# Altium schematic sheet PM_Adapter_Pi_Pico_v3.SchDoc
size A4; SheetNumber: 1; SheetTotal: 1
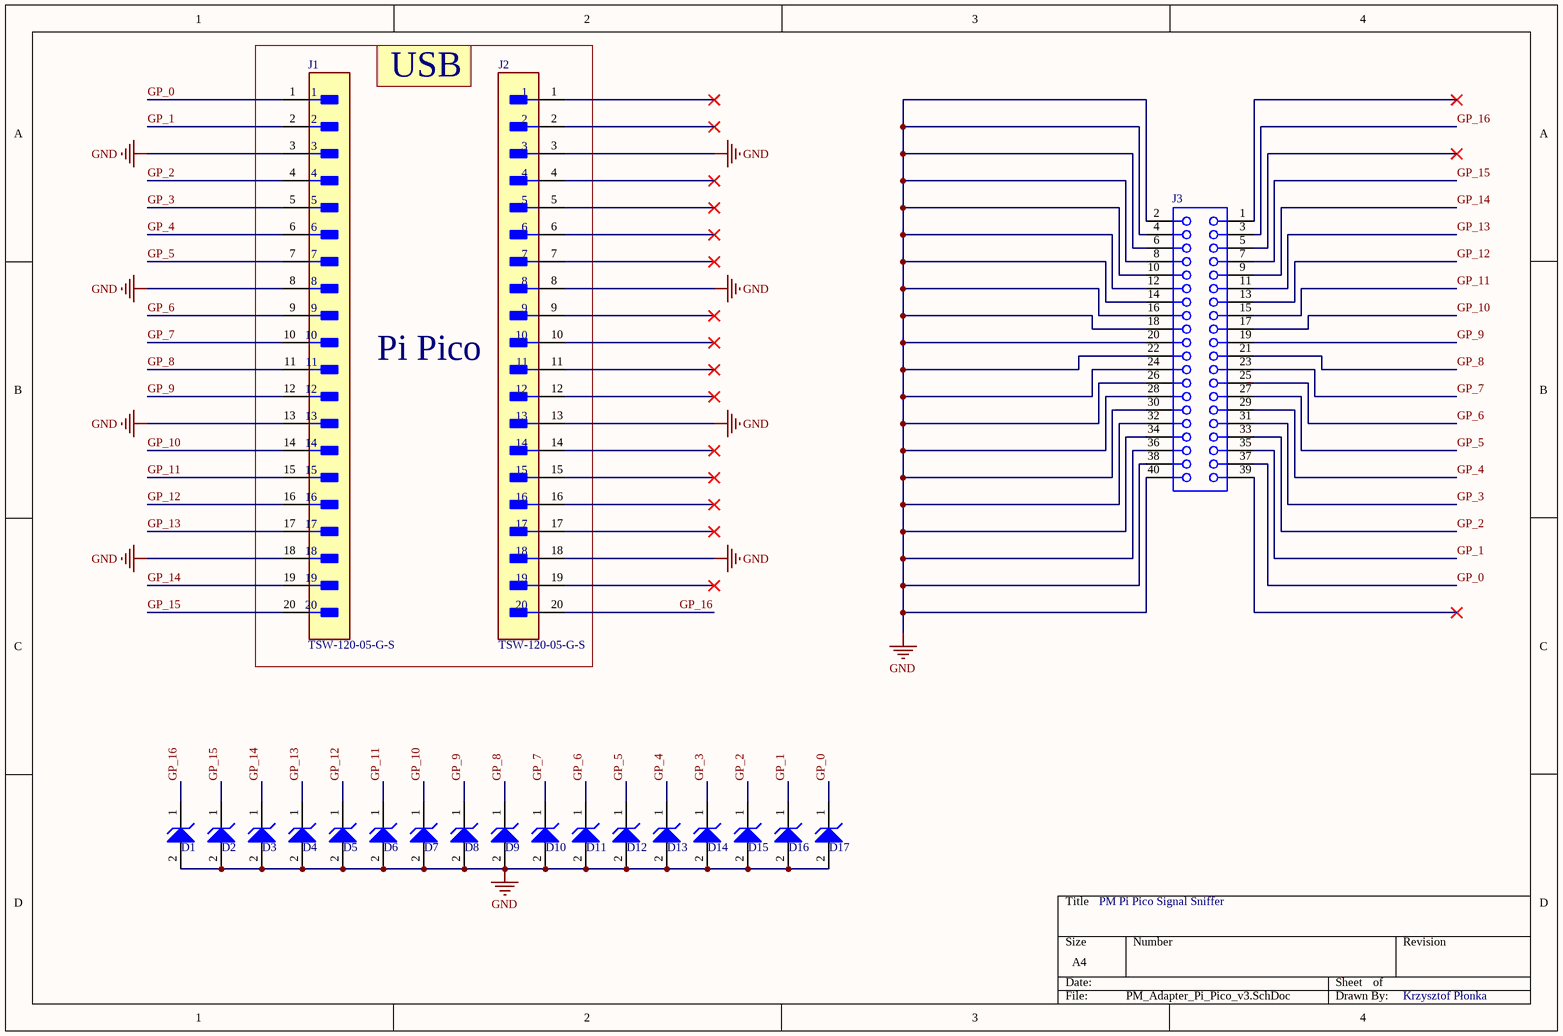
[diagram p0: PM_Adapter_Pi_Pico_v3.SchDoc]

## Parts
D1  MM5Z3V6T1G  [ONSC-SOD-523-2-502-01_V]  (value not drawn)
D2  MM5Z3V6T1G  [ONSC-SOD-523-2-502-01_V]  (value not drawn)
D3  MM5Z3V6T1G  [ONSC-SOD-523-2-502-01_V]  (value not drawn)
D4  MM5Z3V6T1G  [ONSC-SOD-523-2-502-01_V]  (value not drawn)
D5  MM5Z3V6T1G  [ONSC-SOD-523-2-502-01_V]  (value not drawn)
D6  MM5Z3V6T1G  [ONSC-SOD-523-2-502-01_V]  (value not drawn)
D7  MM5Z3V6T1G  [ONSC-SOD-523-2-502-01_V]  (value not drawn)
D8  MM5Z3V6T1G  [ONSC-SOD-523-2-502-01_V]  (value not drawn)
D9  MM5Z3V6T1G  [ONSC-SOD-523-2-502-01_V]  (value not drawn)
D10  MM5Z3V6T1G  [ONSC-SOD-523-2-502-01_V]  (value not drawn)
D11  MM5Z3V6T1G  [ONSC-SOD-523-2-502-01_V]  (value not drawn)
D12  MM5Z3V6T1G  [ONSC-SOD-523-2-502-01_V]  (value not drawn)
D13  MM5Z3V6T1G  [ONSC-SOD-523-2-502-01_V]  (value not drawn)
D14  MM5Z3V6T1G  [ONSC-SOD-523-2-502-01_V]  (value not drawn)
D15  MM5Z3V6T1G  [ONSC-SOD-523-2-502-01_V]  (value not drawn)
D16  MM5Z3V6T1G  [ONSC-SOD-523-2-502-01_V]  (value not drawn)
D17  MM5Z3V6T1G  [ONSC-SOD-523-2-502-01_V]  (value not drawn)
J1  TSW-120-05-G-S  [FP-TSW-120-05-G-S-MFG]
J2  TSW-120-05-G-S  [FP-TSW-120-05-G-S-MFG]
J3  SSW-120-02-G-D-RA  [SMTC-SSW-120-02-X-D-RA]  (value not drawn)

## Nets
GND: D1.2(A) D2.2(A) D3.2(A) D4.2(A) D5.2(A) D6.2(A) D7.2(A) D8.2(A) D9.2(A) D10.2(A) D11.2(A) D12.2(A) D13.2(A) D14.2(A) D15.2(A) D16.2(A) D17.2(A) J1.3 J1.8 J1.13 J1.18 J2.3 J2.8 J2.13 J2.18 J3.2 J3.4 J3.6 J3.8 J3.10 J3.12 J3.14 J3.16 J3.18 J3.20 J3.22 J3.24 J3.26 J3.28 J3.30 J3.32 J3.34 J3.36 J3.38 J3.40
GP_0: D17.1(K) J1.1 J3.37
GP_1: D16.1(K) J1.2 J3.35
GP_2: D15.1(K) J1.4 J3.33
GP_3: D14.1(K) J1.5 J3.31
GP_4: D13.1(K) J1.6 J3.29
GP_5: D12.1(K) J1.7 J3.27
GP_6: D11.1(K) J1.9 J3.25
GP_7: D10.1(K) J1.10 J3.23
GP_8: D9.1(K) J1.11 J3.21
GP_9: D8.1(K) J1.12 J3.19
GP_10: D7.1(K) J1.14 J3.17
GP_11: D6.1(K) J1.15 J3.15
GP_12: D5.1(K) J1.16 J3.13
GP_13: D4.1(K) J1.17 J3.11
GP_14: D3.1(K) J1.19 J3.9
GP_15: D2.1(K) J1.20 J3.7
GP_16: D1.1(K) J2.20 J3.3

Not connected (* = marked no-connect by the designer): J2 1* 2* 4* 5* 6* 7* 9* 10* 11* 12* 14* 15* 16* 17* 19*; J3 1* 5* 39*

## Notes on the sheet
- USB
- (near J2) Pi Pico
- PM Pi Pico Signal Sniffer
- Krzysztof Płonka

## Library data of the parts
D1-D17 = CMP-1060-00749-1: Zener Voltage Regulator, 500 mW, 2-Pin SOD-523, Pb-Free, Tape and Reel; Manufacturer: On Semiconductor; P Max (W): 0.5; VZ Typ (V): 3.6; PackageVersion: Rev. E, 09/2010; Packing: Tape and Reel; DatasheetVersion: Rev. 10; ComponentLink2URL: http://www.onsemi.cn/pub_link/Collateral/MM5Z2V4T1-D.PDF; ComponentLink3Description: Package Specification; ComponentLink1URL: http://www.onsemi.com/; RoHS: Pb-Free; PartNumber: MM5Z3V6T1G; PackageDescription: 2-Pin SOD, Body 1.2 x 0.8 mm; ComponentLink1Description: Manufacturer URL; ComponentLink3URL: http://www.onsemi.com/pub_link/Collateral/502-01.PDF; Mounting Technology: Surface Mount; PackageReference: SOD-523-2-502-01; ComponentLink2Description: Datasheet
J1 J2 = CMP-00575-00271415-1: TSW-120-05-G-S Headers & Wire Housings Classic PCB Header Strips, 0.100 pitch; NexarPartId: 271415; Manufacturer Lifecycle Status: PRODUCTION; Number of Contacts: 20; Gender: Male; Pitch: 2.54mm; Connector Type: Male Pin; Lead Free: Lead Free; Housing Material: Plastic; RoHS: Compliant; Housing Color: Black; Width: 2.54mm; Height: 2.54mm; Contact Plating: Gold; Lead Pitch: 2.54mm; Color: Black; Number of Positions: 20; Lifecycle Status: Production; Contact Material: Bronze; Contact Mating Length: 2.667mm; Length: 50.8mm; REACH SVHC: No SVHC; Termination: Solder; Mount: Through Hole; Number of Rows: 1
J3 = CMP-1023-00460-1: SQ Post Socket, Through-hole, Right Angle, -55 to 125 degC, 2.54 mm Pitch, 40-Pin, Female, RoHS; Manufacturer: Samtec; Pitch: 2.54 mm; ComponentLink2Description: Datasheet; ComponentLink3Description: Package Specification; PackageVersion: CA, 6/1987; ComponentLink1URL: http://www.samtec.com; ComponentLink3URL: http://www.samtec.com/documents/webfiles/cpdf/SSW-1XX-XX-XXX-X-XX-XXX-XX-MKT.pdf; Orientation: Right Angle; PackageReference: SSW-120-02-X-D-RA; ComponentLink2URL: http://www.samtec.com/documents/webfiles/pdf/SSW_TH.PDF; PackageDescription: Assembly, Socket Strip .016 X .031 Tail; Temperature Range: -55 to 125 degC; DatasheetVersion: F-214; RoHS: True; ComponentLink1Description: Manufacturer URL; Mounting Technology: Through-hole; PartNumber: SSW-120-02-G-D-RA